# EAGLE design board_v3 (EAGLE 7.2.0)
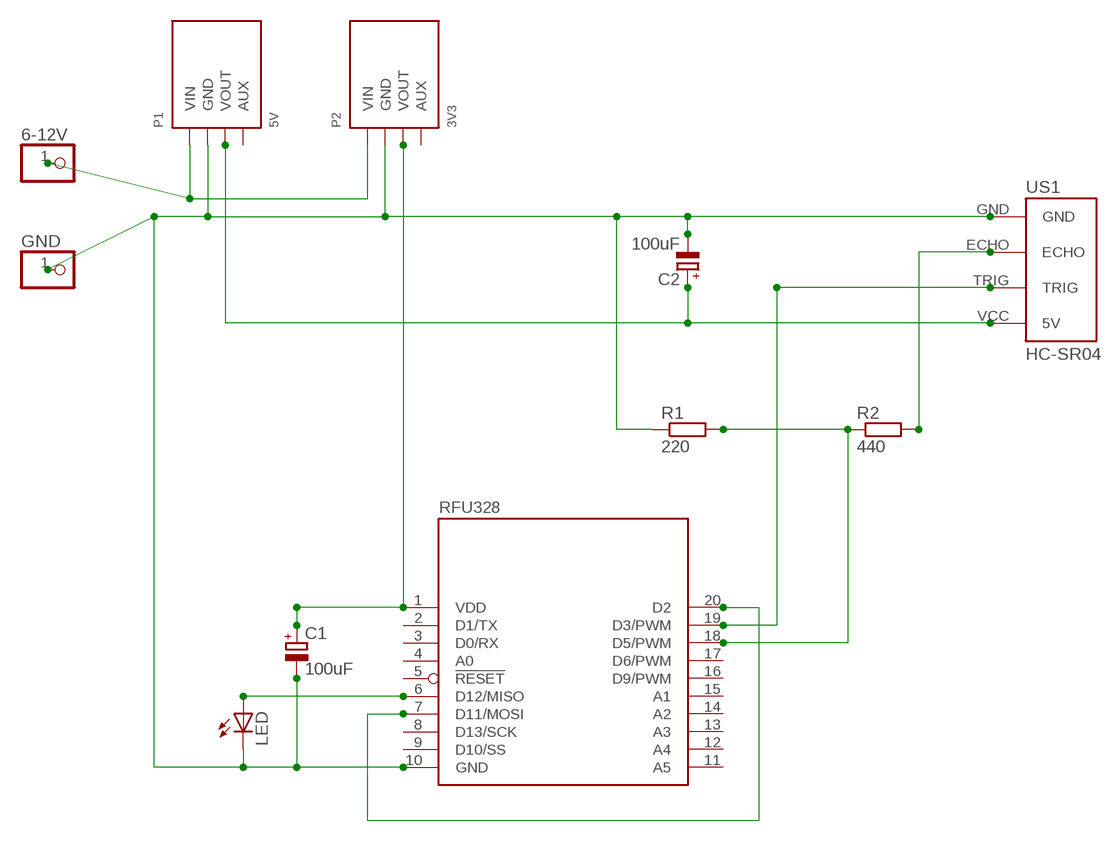
[diagram p0: schematic, sheet 1]

## Parts
6-12V  PINHD-1X1  [1X01]
C1  100uF  CPOL-EUE5-5  [E5-5]
C2  100uF  CPOL-EUE5-5  [E5-5]
GND  PINHD-1X1  [1X01]
LED  TLLR4400  [LED3MM]
P1  5V  POWER-POD-REFRENCE  [POWER-POD-REF]
P2  3V3  POWER-POD-REFRENCE  [POWER-POD-REF]
R1  220  R-EU_0207/7  [0207/7]
R2  440  R-EU_0207/7  [0207/7]
RFU328  RFµ-328-SOCKET-V2.0  [RFµ-SOCKET-V2.0]
US1  HC-SR04  [HC-SR04_FOOTPRINT]

## Nets
GND: C1.- C2.- GND.1 LED.K(C) P1.2(GND) P2.2(GND) R1.1 RFU328.10(GND) US1.GND
N$1: LED.A RFU328.6(D12/MISO)
N$2: R2.2 US1.ECHO
N$3: RFU328.7(D11/MOSI) RFU328.20(D2)
N$5: C2.+ P1.3(VOUT) US1.VCC(5V)
N$6: R1.2 R2.1 RFU328.18(D5/PWM)
N$7: RFU328.19(D3/PWM) US1.TRIG
N$8: 6-12V.1 P1.1(VIN) P2.1(VIN)
VDD: C1.+ P2.3(VOUT) RFU328.1(VDD)
Unconnected: P1.4(AUX) P2.4(AUX) RFU328.2(D1/TX) RFU328.3(D0/RX) RFU328.4(A0) RFU328.5(!RESET) RFU328.8(D13/SCK) RFU328.9(D10/SS) RFU328.11(A5) RFU328.12(A4) RFU328.13(A3) RFU328.14(A2) RFU328.15(A1) RFU328.16(D9/PWM) RFU328.17(D6/PWM)

## Library data of the parts
6-12V GND = adafruit:PINHD-1X1: Pin header 1x1 for 0.1" spacing With round pins
C1 C2 = rcl:CPOL-EU: POLARIZED CAPACITOR, European symbol
LED = led:TLLR4400: Low Current (2mA) LED 3 mm Tinted Diffused Package color RED Source: Data sheet <http://www.farnell.com/datasheets/391100.pdf>; MF: VISHAY SEMICONDUCTOR; OC_FARNELL: 1612437
P1 P2 = con-ciseco:POWER-POD
R1 R2 = rcl:R-EU_: RESISTOR, European symbol
RFU328 = Ciseco Footprints:RFµ-328
US1 = Ultrasonic Sensor HC-SR04:HC-SR04: Ultrasonic Sensor HC-SR04

## Board
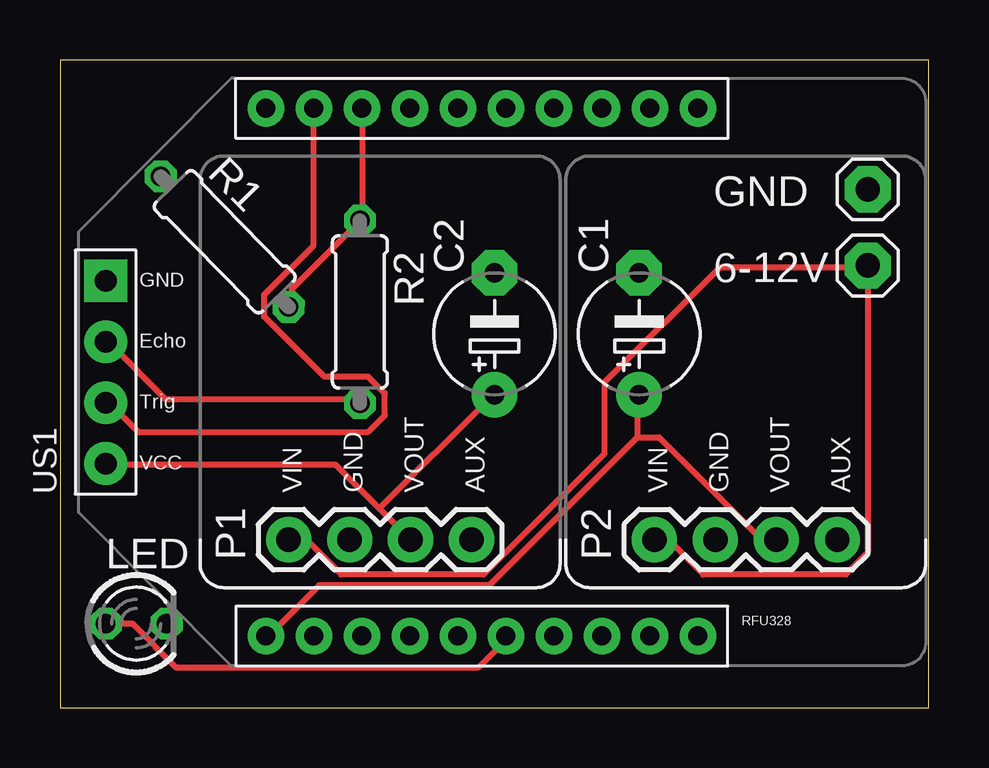
[diagram p1: board, top side]
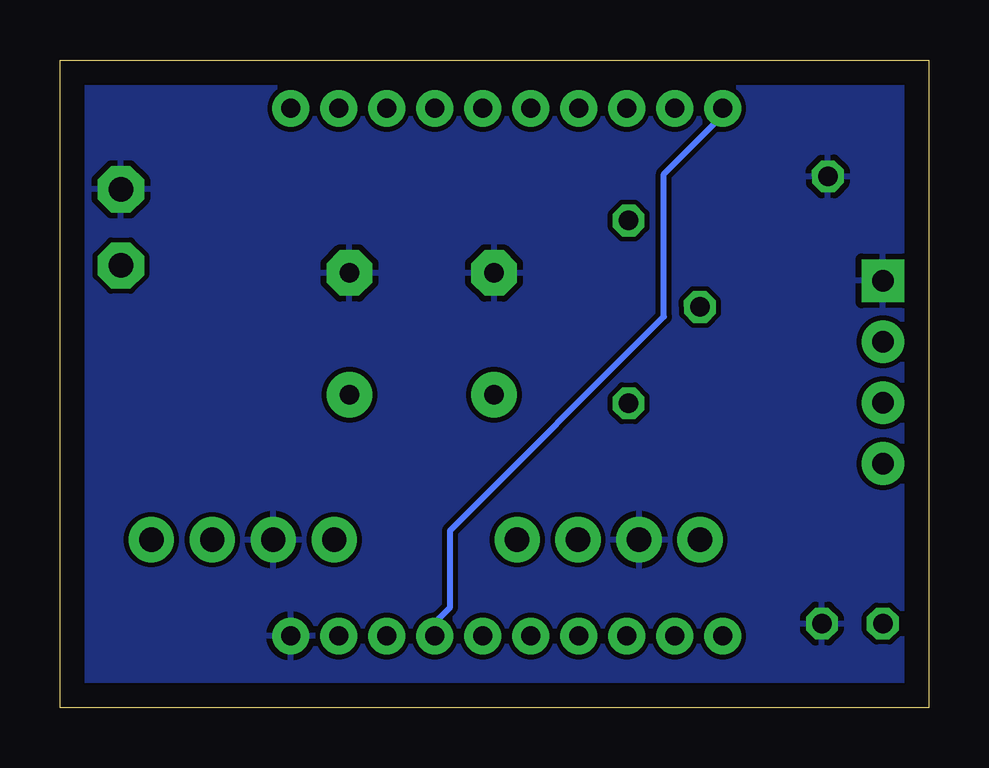
[diagram p2: board, bottom side, seen from below]

Size 36.19 x 27.02 mm. Coordinates in mm from the lower left corner, seen from the top.
Outline: 0,0 36.19,0 36.19,27.02 0,27.02 0,0
Copper layers (1*16): Top 0.035mm / dielectric 1.5mm / Bottom 0.035mm
Design rules "default": minimum track width 10mil, minimum drill 24mil, track to track 8mil, track to pad 8mil, pad to pad 8mil, via to via 8mil, smd to smd 8mil, copper to edge 40mil, drill to drill 8mil, minimum pad ring 10mil, minimum via ring 8mil, stop-mask expansion 4mil, vias tented up to drill 0mil, thermal gap 10mil

### Footprints (pad centres in the part's own frame; a part is rotated, then mirrored left to right if it is on the bottom)
1X01 = drill 1.016 pad 1.93 octagon: 1 0,0
E5-5 = drill 0.813 pad 1.905: + -2.54,0 | drill 0.813 pad 1.905 octagon: - 2.54,0
LED3MM = drill 0.813 octagon: A -1.27,0; K 1.27,0
POWER-POD-REF = drill 1.016 pad 1.88: 1 -3.81,0; 2 -1.27,0; 3 1.27,0; 4 3.81,0
0207/7 = drill 0.813 octagon: 1 -3.81,0; 2 3.81,0
RFµ-SOCKET-V2.0 = drill 0.8 pad 1.524: 1 -11,20; 2 -11,18; 3 -11,16; 4 -11,14; 5 -11,12; 6 -11,10; 7 -11,8; 8 -11,6; 9 -11,4; 10 -11,2; 11 11,2; 12 11,4; 13 11,6; 14 11,8; 15 11,10; 16 11,12; 17 11,14; 18 11,16; 19 11,18; 20 11,20
HC-SR04_FOOTPRINT = drill 0.9 pad 1.778: ECHO 0,1.27; TRIG 0,-1.27; VCC 0,-3.81 | drill 0.9 pad 1.778 square: GND 0,3.81

### Placement (x,y rotation side)
6-12V  33.66,18.45 0 top
C1  24.13,15.6 90 top
C2  18.11,15.6 90 top
GND  33.66,21.62 0 top
LED  3.17,3.52 0 top
P1  13.34,7.02 0 top
P2  28.57,7.02 0 top
R1  6.86,19.44 314.4 top
R2  12.5,16.51 270 top
RFU328  28.57,14 90 top
US1  1.91,14 0 top

### Tracks (layer width: path | path; a pad name or v marks a point on that pad's centre or on a via)
GND
  pour Bottom: 0.02,27.02 36.1,27.02 36.1,0.03 0.02,0.03
N$1
  Top 0.254: LED.A 2.11,3.51 3.02,3.51 4.85,1.68 17.42,1.68 18.57,2.82 RFU328.6
N$2
  Top 0.254: R2.2 12.39,12.88 4.39,12.88 2.11,15.17 US1.ECHO
N$3
  Bottom 0.254: RFU328.20 8.74,25 8.74,24.54 11.02,22.26 11.02,16.31 19.94,7.4 19.94,4.2 20.4,3.74 20.4,3.05 RFU328.7
N$5
  Top 0.254: P1.3 13.31,8.31 | 13.31,8.31 11.48,10.14 2.11,10.14 US1.VCC | 13.31,8.31 17.88,12.88 C2.+
N$6
  Top 0.254: R1.2 9.65,16.77 9.65,17.45 12.39,20.2 R2.1 12.62,20.43 12.62,25 RFU328.18
N$7
  Top 0.254: RFU328.19 10.57,19.28 8.51,17.23 8.51,16.31 11.02,13.8 12.85,13.8 13.54,13.11 13.54,12.2 12.85,11.51 3.25,11.51 2.11,12.65 US1.TRIG
N$8
  Top 0.254: 33.66,18.37 27.48,18.37 22.68,13.57 22.68,10.6 17.65,5.57 11.71,5.57 10.34,6.94 9.65,6.94 P1.1 | 33.66,18.37 33.66,6.48 32.74,5.57 26.8,5.57 25.42,6.94 24.97,6.94 P2.1 | 33.66,18.37 6-12V.1
VDD
  Top 0.254: 24.05,11.28 17.88,5.11 10.79,5.11 8.74,3.05 RFU328.1 | 24.05,11.28 24.05,12.88 C1.+ | 24.05,11.28 24.97,11.28 29.08,7.17 29.77,7.17 P2.3